# EAGLE design Wash_Hand_v1.3 (EAGLE 9.6.2)

## Sheet 1 of 2
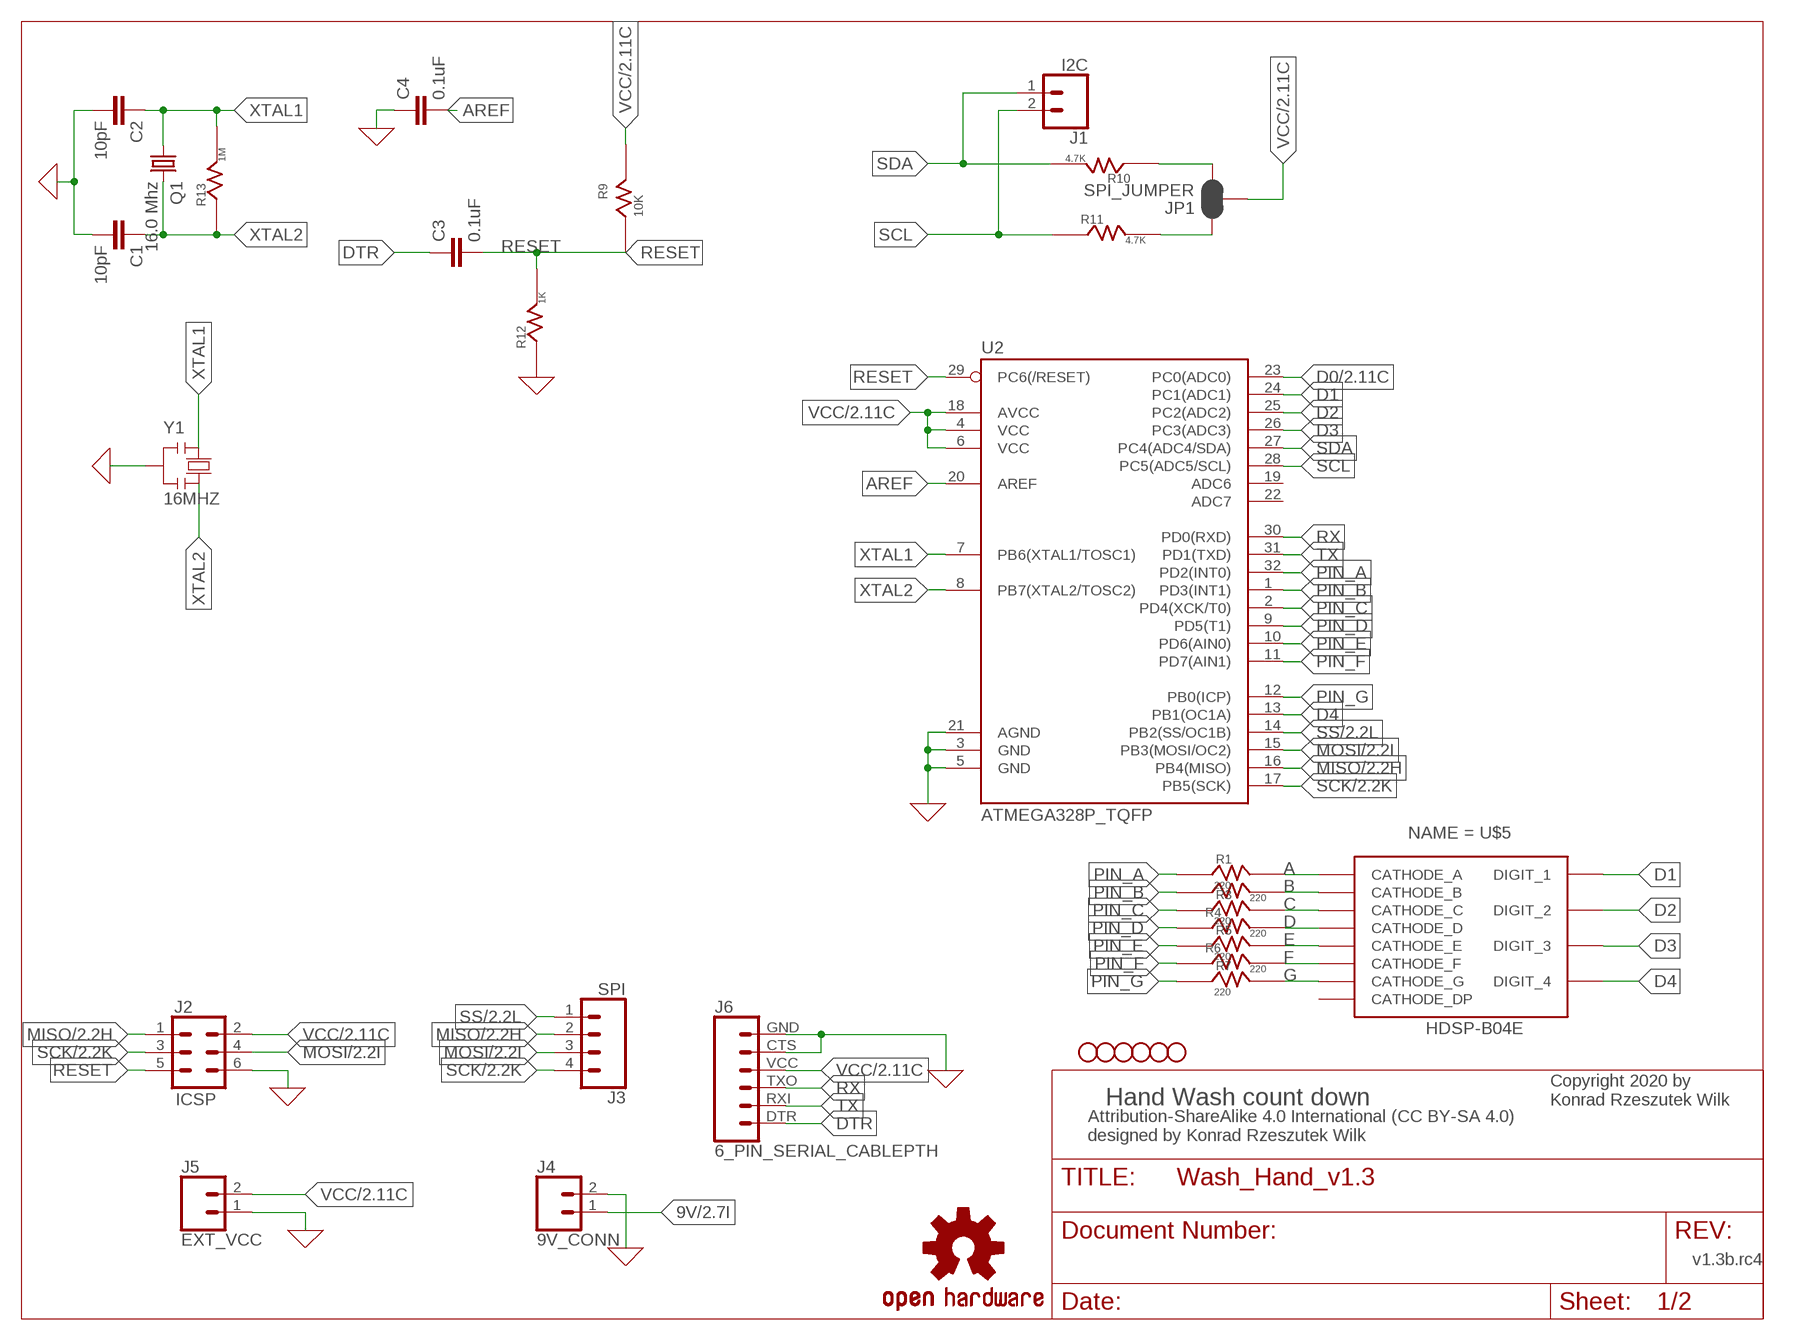
[diagram p0: schematic, sheet 1]
FRAME1 (LETTER_L): REVISION: v1.3b.rc4

### Parts
C1  10pF  10UF-1206-6.3V-20%  [1206]
C2  10pF  10UF-1206-6.3V-20%  [1206]
C3  0.1uF  1.0UF-1206-50V-10%  [1206]
C4  0.1uF  1.0UF-1206-50V-10%  [1206]
H1  STAND-OFF  [STAND-OFF]
H2  STAND-OFF  [STAND-OFF]
H3  STAND-OFF  [STAND-OFF]
H4  STAND-OFF  [STAND-OFF]
H5  STAND-OFF  [STAND-OFF]
H6  STAND-OFF  [STAND-OFF]
J1  I2C  CONN_02  [1X02]
J2  ICSP  CONN_03X2FEMALE  [2X3]
J3  SPI  CONN_04  [1X04]
J4  9V_CONN  CONN_02  [1X02]
J5  EXT_VCC  CONN_02  [1X02]
J6  6_PIN_SERIAL_CABLEPTH  [FTDI_BASIC]
JP1  SPI_JUMPER  JUMPER-SMT_3_2-NC_PASTE_SILK  [SMT-JUMPER_3_2-NC_PASTE_SILK]
LOGO1  OSHW-LOGOM  [OSHW-LOGO-M]
Q1  16.0 Mhz  CRYSTALHC49S  [HC49/S]
R1  220  RESISTORR1206  [1206]
R2  220  RESISTORR1206  [1206]
R3  220  RESISTORR1206  [1206]
R4  220  RESISTORR1206  [1206]
R5  220  RESISTORR1206  [1206]
R6  220  RESISTORR1206  [1206]
R7  220  RESISTORR1206  [1206]
R9  10K  RESISTORR1206  [1206]
R10  4.7K  RESISTORR1206  [1206]
R11  4.7K  RESISTORR1206  [1206]
R12  1K  RESISTORR1206  [1206]
R13  1M  RESISTORR1206  [1206]
U2  ATMEGA328P_TQFP  [TQFP32-08]
U$5  HDSP-B04E  [HDSP-B0XE]
Y1  16MHZ  RESONATORMU  [RESONATOR]

### Nets
0: C1.2 C2.2 C4.1 J2.6 J4.2 J5.1 J6.CTS J6.GND R12.1(R_1) U2.3(GND) U2.5(GND) U2.21(AGND) Y1.2 ; supply symbol labelled GND ; also sheet 2
9V: J4.1 ; also sheet 2
A: R1.2(R_2) U$5.PIN$11(CATHODE_A)
AREF: C4.2 U2.20(AREF)
B: R2.2(R_2) U$5.PIN$7(CATHODE_B)
C: R3.2(R_2) U$5.PIN$4(CATHODE_C)
D: R4.2(R_2) U$5.PIN$2(CATHODE_D)
D0: U2.23(PC0(ADC0)) ; also sheet 2
D1: U2.24(PC1(ADC1)) U$5.PIN12(DIGIT_1)
D2: U2.25(PC2(ADC2)) U$5.PIN$9(DIGIT_2)
D3: U2.26(PC3(ADC3)) U$5.PIN$8(DIGIT_3)
D4: U2.13(PB1(OC1A)) U$5.PIN$6(DIGIT_4)
DTR: C3.1 J6.DTR
E: R5.2(R_2) U$5.PIN$1(CATHODE_E)
F: R6.2(R_2) U$5.PIN$10(CATHODE_F)
G: R7.2(R_2) U$5.PIN$5(CATHODE_G)
MISO: J2.1 J3.2 U2.16(PB4(MISO)) ; also sheet 2
MOSI: J2.4 J3.3 U2.15(PB3(MOSI/OC2)) ; also sheet 2
N$5: JP1.3 R10.1(R_1)
N$6: JP1.1 R11.2(R_2)
PIN_A: R1.1(R_1) U2.32(PD2(INT0))
PIN_B: R2.1(R_1) U2.1(PD3(INT1))
PIN_C: R3.1(R_1) U2.2(PD4(XCK/T0))
PIN_D: R4.1(R_1) U2.9(PD5(T1))
PIN_E: R5.1(R_1) U2.10(PD6(AIN0))
PIN_F: R6.1(R_1) U2.11(PD7(AIN1))
PIN_G: R7.1(R_1) U2.12(PB0(ICP))
RESET: C3.2 J2.5 R9.1(R_1) R12.2(R_2) U2.29(PC6(/RESET))
RX: J6.TXO U2.30(PD0(RXD))
SCK: J2.3 J3.4 U2.17(PB5(SCK)) ; also sheet 2
SCL: J1.2 R11.1(R_1) U2.28(PC5(ADC5/SCL))
SDA: J1.1 R10.2(R_2) U2.27(PC4(ADC4/SDA))
SS: J3.1 U2.14(PB2(SS/OC1B)) ; also sheet 2
TX: J6.RXI U2.31(PD1(TXD))
VCC: J2.2 J5.2 J6.VCC JP1.2 R9.2(R_2) U2.4(VCC) U2.6(VCC) U2.18(AVCC) ; also sheet 2
XTAL1: C2.1 Q1.1 R13.2(R_2) U2.7(PB6(XTAL1/TOSC1)) Y1.1
XTAL2: C1.1 Q1.2 R13.1(R_1) U2.8(PB7(XTAL2/TOSC2)) Y1.3
Unconnected: U2.19(ADC6) U2.22(ADC7) U$5.PIN$3(CATHODE_DP)

### Notes on the sheet
- Hand Wash count down
- Copyright 2020 by
  Konrad Rzeszutek Wilk
- Attribution-ShareAlike 4.0 International (CC BY-SA 4.0) 
  designed by Konrad Rzeszutek Wilk

## Sheet 2 of 2
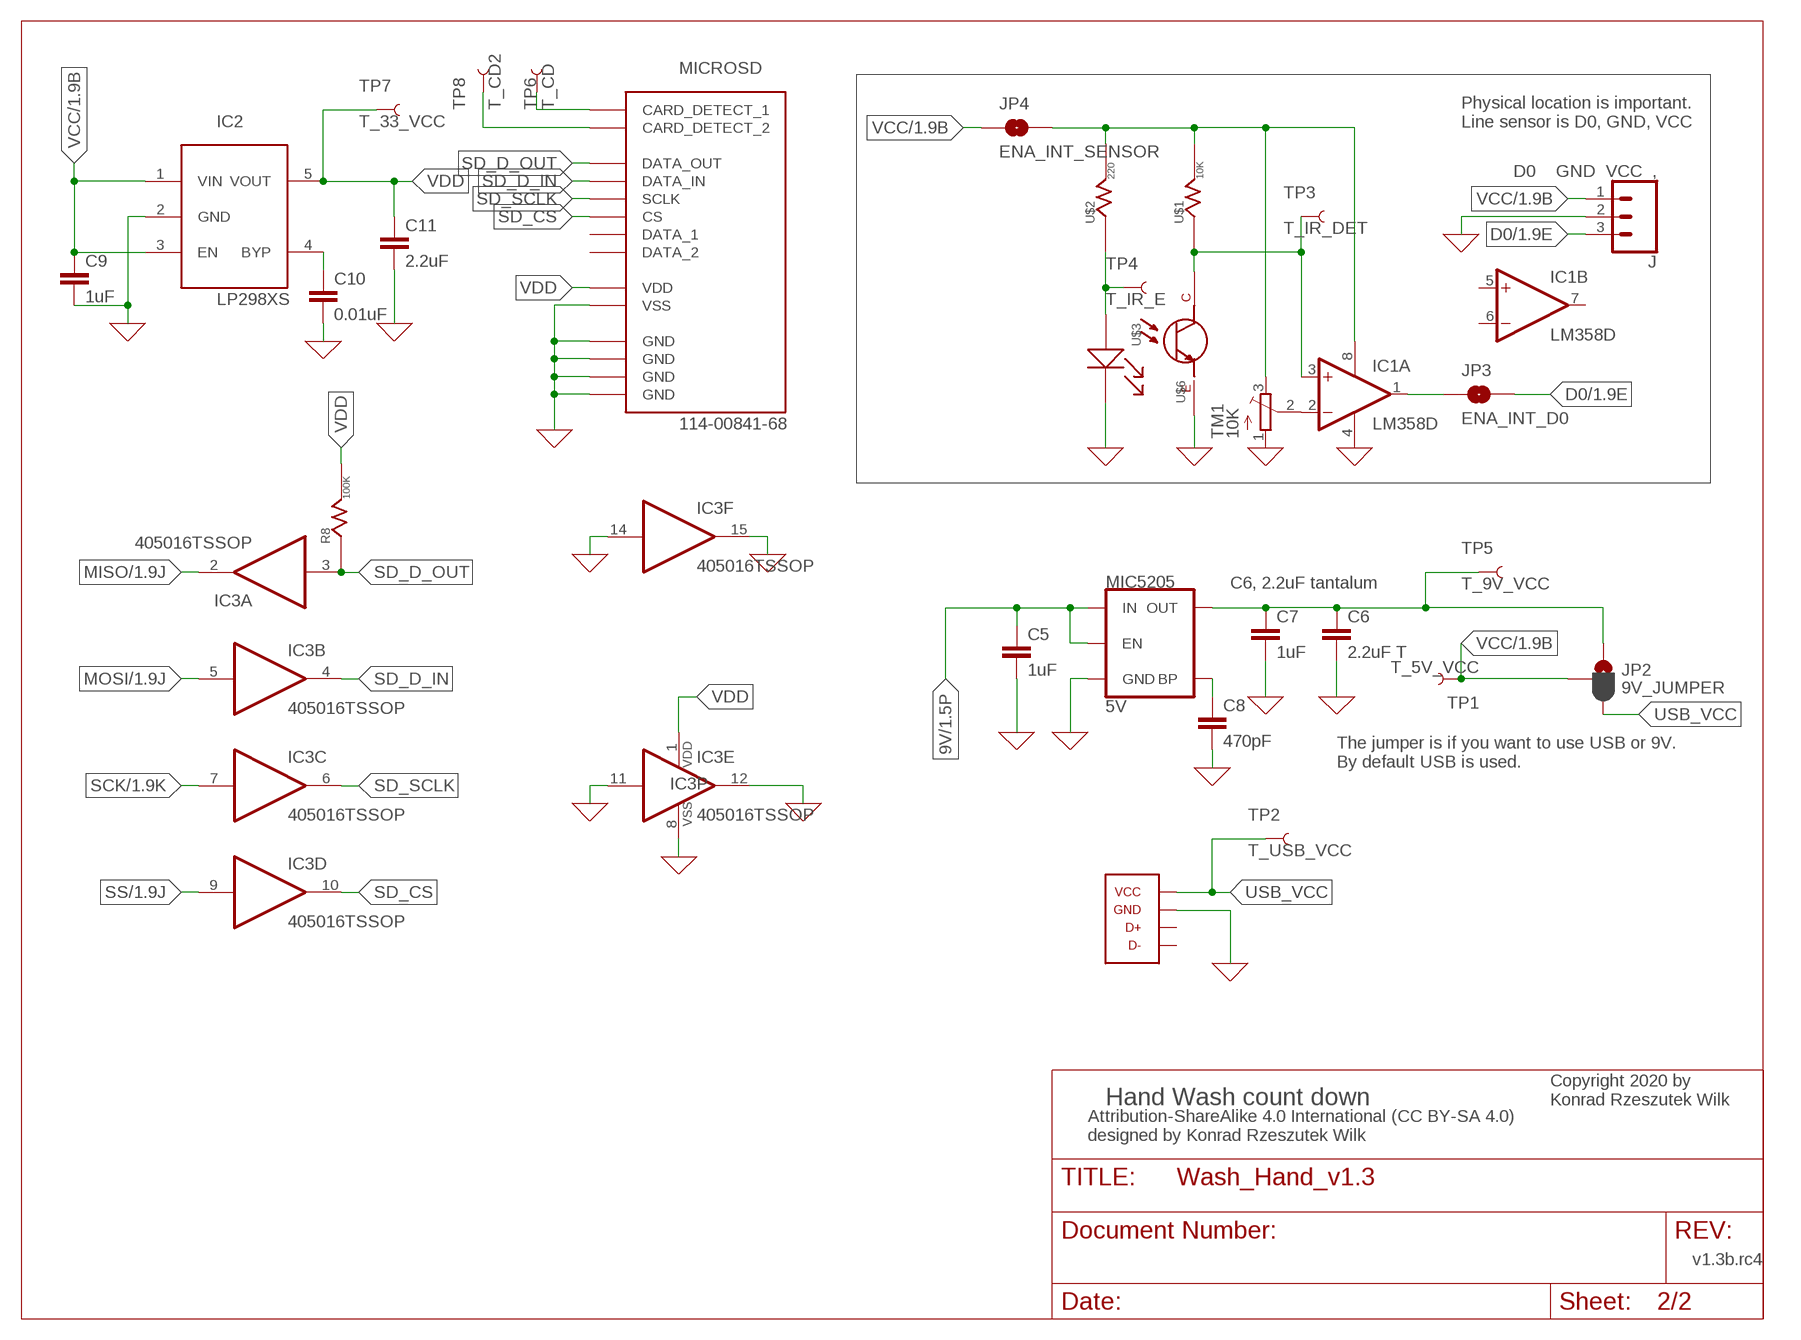
[diagram p1: schematic, sheet 2]
FRAME2 (LETTER_L): REVISION: v1.3b.rc4

### Parts
C5  1uF  1.0UF-1206-50V-10%  [1206]
C6  2.2uF T  1.0UF-1206-50V-10%  [1206]
C7  1uF  1.0UF-1206-50V-10%  [1206]
C8  470pF  1.0UF-1206-50V-10%  [1206]
C9  1uF  1.0UF-1206-50V-10%  [1206]
C10  0.01uF  1.0UF-1206-50V-10%  [1206]
C11  2.2uF  1.0UF-1206-50V-10%  [1206]
IC1  LM358D  [SO08]
IC2  LP298XS  [SOT23-5L]
IC3  405016TSSOP  [TSSOP16]
J  D0 GND VCC ,  CONN_03  [1X03]
JP2  9V_JUMPER  JUMPER-SMT_3_1-NC_PASTE_SILK  [SMT-JUMPER_3_1-NC_PASTE_SILK]
JP3  ENA_INT_D0  JUMPER-SMT_2_NO_NO-SILK_ROUND  [SMT-JUMPER_2_NO_NO-SILK_ROUND]
JP4  ENA_INT_SENSOR  JUMPER-SMT_2_NO_NO-SILK_ROUND  [SMT-JUMPER_2_NO_NO-SILK_ROUND]
MIC5205  5V  V_REG_MIC52055V  [SOT23-5]
MICROSD  114-00841-68  [114-00841-68]
R8  100K  RESISTORR1206  [1206]
TM1  10K  TRIMPOTTC33X  [TC33X]
TP1  T_5V_VCC  TEST-POINT3X4  [PAD.03X.04]
TP2  T_USB_VCC  TEST-POINT3X4  [PAD.03X.04]
TP3  T_IR_DET  TEST-POINT3X4  [PAD.03X.04]
TP4  T_IR_E  TEST-POINT3X4  [PAD.03X.04]
TP5  T_9V_VCC  TEST-POINT3X4  [PAD.03X.04]
TP6  T_CD  TEST-POINT3X4  [PAD.03X.04]
TP7  T_33_VCC  TEST-POINT3X4  [PAD.03X.04]
TP8  T_CD2  TEST-POINT3X4  [PAD.03X.04]
U$1  10K  RESISTORR1206  [1206]
U$2  220  RESISTORR1206  [1206]
U$3  LTE-302  [LTE-302]
U$4  USB_MICROB_10118194_AMPHENOL  [USB_MICROB_10118194_AMPHENOL]
U$6  LTR-301  [LTR-301]

### Nets
0: C5.2 C6.2 C7.2 C8.2 C9.2 C10.2 C11.2 IC1.4(P:V-) IC2.2(GND) IC3.8(P:VSS) IC3.11(E:I) IC3.12(E:O) IC3.14(F:I) IC3.15(F:O) J.2 MIC5205.2(GND) MICROSD.GND$1(GND) MICROSD.GND$2(GND) MICROSD.GND$3(GND) MICROSD.GND$4(GND) MICROSD.VSS TM1.1(A) U$3.C(K$1) U$4.5(GND) U$6.E(E$1) ; supply symbol labelled GND ; also sheet 1
9V: C5.1 MIC5205.1(IN) MIC5205.3(EN) ; also sheet 1
D0: IC1.1(A:OUT) J.3 JP3.1 JP3.2 ; also sheet 1
MISO: IC3.2(A:O) ; also sheet 1
MOSI: IC3.5(B:I) ; also sheet 1
N$1: MICROSD.CD_SW_1(CARD_DETECT_1) TP6.P$1
N$2: MICROSD.CD_SW_2(CARD_DETECT_2) TP8.P$1
N$10: C6.1 C7.1 JP2.1 MIC5205.5(OUT) TP5.P$1
N$11: TP4.P$1 U$2.1(R_1) U$3.A(A$1)
N$13: C10.1 IC2.4(BYP)
N$14: IC1.3(A:+IN) TP3.P$1 U$1.1(R_1) U$6.C(C$1)
N$15: IC1.8(P:V+) JP4.2 TM1.3(E) U$1.2(R_2) U$2.2(R_2)
N$16: IC1.2(A:-IN) TM1.2(S)
N$18: C8.1 MIC5205.4(BP)
SCK: IC3.7(C:I) ; also sheet 1
SD_CS: IC3.10(D:O) MICROSD.CS
SD_D_IN: IC3.4(B:O) MICROSD.DATA_IN
SD_D_OUT: IC3.3(A:I) MICROSD.DATA_OUT R8.1(R_1)
SD_SCLK: IC3.6(C:O) MICROSD.SCLK
SS: IC3.9(D:I) ; also sheet 1
USB_VCC: JP2.3 TP2.P$1 U$4.1(VCC)
VCC: C9.1 IC2.1(VIN) IC2.3(EN) J.1 JP2.2 JP4.1 TP1.P$1 ; also sheet 1
VDD: C11.1 IC2.5(VOUT) IC3.1(P:VDD) MICROSD.VDD R8.2(R_2) TP7.P$1
Unconnected: IC1.5(B:+IN) IC1.6(B:-IN) IC1.7(B:OUT) MICROSD.DATA_1 MICROSD.DATA_2 U$4.2(D-) U$4.3(D+)

### Notes on the sheet
- Physical location is important.
  Line sensor is D0, GND, VCC
- C6, 2.2uF tantalum
- The jumper is if you want to use USB or 9V.
  By default USB is used.
- Hand Wash count down
- Copyright 2020 by
  Konrad Rzeszutek Wilk
- Attribution-ShareAlike 4.0 International (CC BY-SA 4.0) 
  designed by Konrad Rzeszutek Wilk

## Library data of the parts
C1 C2 = SparkFun-Capacitors:10UF: 10.0µF ceramic capacitors A capacitor is a passive two-terminal electrical component used to store electrical energy temporarily in an electric field.; PROD_ID: CAP-10057; VALUE: 10uF
C3-C11 = SparkFun-Capacitors:1.0UF: 1µF ceramic capacitors A capacitor is a passive two-terminal electrical component used to store electrical energy temporarily in an electric field.; PROD_ID: CAP-09822; VALUE: 1.0uF
H1-H6 = SparkFun-Hardware:STAND-OFF: Stand Off Drill holes for mechanically mounting via screws, standoffs, etc. Note: Use the keepout ring to avoid running the screw head into surrounding components. Variant Overviews STAND-OFF - Mechanical footprint for a #4 phillips button head screw. STAND-OFF-TIGHT - Mechanical footprint for a #4 phillips button head screw, Example SparkFun Products Screw - Phillips Head (1/4", 4-40, 10 pack) <https://www.sparkfun.com/products/10453> (PRT-10453) Screw - Phillips Head (1/2", 4-40, 10 pack) <https://www.sparkfun.com/products/10452> (PRT-10452) Screw - Phillips Head (3/4", 4-40, 10 pack) <https://www.sparkfun.com/products/10451> (PRT-10451) Screw - Phillips Head (1", 4-40, 10 pack) <https://www.sparkfun.com/products/10450> (PRT-10450)
IC1 = linear:LM358: OP AMP also LM158; LM258; LM2904 Source: http://cache.national.com/ds/LM/LM158.pdf
IC2 = adafruit:LP298X
IC3 = darnok_4050:4050: Hex non-inverting BUFFER aka CD74HC4050PWR
J = SparkFun-Connectors:CONN_03: Multi connection point. Often used as Generic Header-pin footprint for 0.1 inch spaced/style header connections On any of the 0.1 inch spaced packages, you can populate with these: Break Away Headers - Straight <https://www.sparkfun.com/products/116> (PRT-00116) Break Away Male Headers - Right Angle <https://www.sparkfun.com/products/553> (PRT-00553) Female Headers <https://www.sparkfun.com/products/115> (PRT-00115) Break Away Headers - Machine Pin <https://www.sparkfun.com/products/117> (PRT-00117) Break Away Female Headers - Swiss Machine Pin <https://www.sparkfun.com/products/743> (PRT-00743) Stackable Header - 3 Pin (Female, 0.1") <https://www.sparkfun.com/products/13875> (PRT-13875) For SCREWTERMINALS and SPRING TERMINALS visit here: Screw Terimnals on SparkFun.com <https://www.sparkfun.com/search/results?term=Screw+Terminals> (5mm/3.5mm/2.54mm spacing) This device is also useful as a general connection point to wire up your design to another part of your project. Our various solder wires solder well into these plated through hole pads. Hook-Up Wire - Assortment (Stranded, 22 AWG) <https://www.sparkfun.com/products/11375> (PRT-11375) Hook-Up Wire - Assortment (Solid Core, 22 AWG) <https://www.sparkfun.com/products/11367> (PRT-11367) View the entire wire category on our website here <https://www.sparkfun.com/categories/141> Special notes: Molex polarized connector foot print use with SKU : PRT-08232 with associated crimp pins and housings.
J1 J4 J5 = SparkFun-Connectors:CONN_02: Multi connection point. Often used as Generic Header-pin footprint for 0.1 inch spaced/style header connections On any of the 0.1 inch spaced packages, you can populate with these: Break Away Headers - Straight <https://www.sparkfun.com/products/116> (PRT-00116) Break Away Male Headers - Right Angle <https://www.sparkfun.com/products/553> (PRT-00553) Female Headers <https://www.sparkfun.com/products/115> (PRT-00115) Break Away Headers - Machine Pin <https://www.sparkfun.com/products/117> (PRT-00117) Break Away Female Headers - Swiss Machine Pin <https://www.sparkfun.com/products/743> (PRT-00743) For SCREWTERMINALS and SPRING TERMINALS visit here: Screw Terimnals on SparkFun.com <https://www.sparkfun.com/search/results?term=Screw+Terminals> (5mm/3.5mm/2.54mm spacing) This device is also useful as a general connection point to wire up your design to another part of your project. Our various solder wires solder well into these plated through hole pads. Hook-Up Wire - Assortment (Stranded, 22 AWG) <https://www.sparkfun.com/products/11375> (PRT-11375) Hook-Up Wire - Assortment (Solid Core, 22 AWG) <https://www.sparkfun.com/products/11367> (PRT-11367) View the entire wire category on our website here <https://www.sparkfun.com/categories/141> Special notes: Molex polarized connector foot print use with: PRT-08233 with associated crimp pins and housings. 2.54_SCREWTERM for use with PRT-10571. 3.5mm Screw Terminal footprints for PRT-08084 5mm Screw Terminal footprints for use with PRT-08432
J2 = SparkFun-Connectors:CONN_03X2: Multi connection point. Often used as Generic Header-pin footprint for 0.1 inch spaced/style header connections You can populate with any combo of single row headers, but if you'd like an exact match, check these: Header - 2x3 (Male, 0.1") <https://www.sparkfun.com/products/12807> (PRT-12807) Header - 2x3 (Female, 0.1") <https://www.sparkfun.com/products/13010> (PRT-13010) 2x3 Pin Shrouded Header <https://www.sparkfun.com/products/10877> (PRT-10877) On any of the 0.1 inch spaced packages, you can populate with these: Break Away Headers - Straight <https://www.sparkfun.com/products/116> (PRT-00116) Break Away Male Headers - Right Angle <https://www.sparkfun.com/products/553> (PRT-00553) Female Headers <https://www.sparkfun.com/products/115> (PRT-00115) Break Away Headers - Machine Pin <https://www.sparkfun.com/products/117> (PRT-00117) Break Away Female Headers - Swiss Machine Pin <https://www.sparkfun.com/products/743> (PRT-00743) Special note: the shrouded connector mates well with our 3x2 ribbon cables: Ribbon Crimp Connector - 6-pin (2x3, Female) <https://www.sparkfun.com/products/10651> (PRT-10651) Ribbon Cable - 6 wire (15ft) <https://www.sparkfun.com/products/10646> (PRT-10646); PROD_ID: CONN-11566; VALUE: FEMALE 2x3
J3 = SparkFun-Connectors:CONN_04: Multi connection point. Often used as Generic Header-pin footprint for 0.1 inch spaced/style header connections On any of the 0.1 inch spaced packages, you can populate with these: Break Away Headers - Straight <https://www.sparkfun.com/products/116> (PRT-00116) Break Away Male Headers - Right Angle <https://www.sparkfun.com/products/553> (PRT-00553) Female Headers <https://www.sparkfun.com/products/115> (PRT-00115) Break Away Headers - Machine Pin <https://www.sparkfun.com/products/117> (PRT-00117) Break Away Female Headers - Swiss Machine Pin <https://www.sparkfun.com/products/743> (PRT-00743) For SCREWTERMINALS and SPRING TERMINALS visit here: Screw Terimnals on SparkFun.com <https://www.sparkfun.com/search/results?term=Screw+Terminals> (5mm/3.5mm/2.54mm spacing) This device is also useful as a general connection point to wire up your design to another part of your project. Our various solder wires solder well into these plated through hole pads. Hook-Up Wire - Assortment (Stranded, 22 AWG) <https://www.sparkfun.com/products/11375> (PRT-11375) Hook-Up Wire - Assortment (Solid Core, 22 AWG) <https://www.sparkfun.com/products/11367> (PRT-11367) View the entire wire category on our website here <https://www.sparkfun.com/categories/141> Special notes: Molex polarized connector foot print use with SKU : PRT-08231 with associated crimp pins and housings. 1MM SMD Version SKU: PRT-10208; PROD_ID: CONN-09696
J6 = SparkFun-Connectors:6_PIN_SERIAL_CABLE: 6-pin header connection for use with the "FTDI BASIC" pinout - CABLE SIDE. Also known as "Arduino Serial Program Header". This is used on a design to provide a 6-pin connection point for serial communication usually from a USB cable (D+/D-) to these headers (RX/TX). It also has the remaining pins necessary for programming in the Arduino evironment (DTR, GND, and sometimes VCC). Note, this device has "CABLE" in the name. It is intended to be used on a design that usually lives on the end of your USB cable and prvides the converter chip (FTDI232 or FTDI231x) to commnicate serial RX/TX. The "sister" device, named "TARGET" is inteneded to be used on a design that contains a target micro-controller that you wish to program. You can populate with some of these: Female Headers <https://www.sparkfun.com/products/115> (PRT-00115) For reference (or to suit your programming needs) check out these designs: SparkFun FTDI Basic Breakout - 5V <https://www.sparkfun.com/products/9716> (DEV-09716) SparkFun FTDI Basic Breakout - 3.3V <https://www.sparkfun.com/products/9873> (DEV-09873) SparkFun FTDI SmartBasic <https://www.sparkfun.com/products/12935> (DEV-12935) SparkFun Beefy 3 - FTDI Basic Breakout <https://www.sparkfun.com/products/13746> (DEV-13746)
JP1 = SparkFun-Jumpers:JUMPER-SMT_3_2-NC_PASTE: Normally closed solder jumper (2 of 2 connections) This jumper has an aperture in the stencil to allow solder paste to bridge both connections. Both connections are normally closed (NC). Wick off the solder to open the connection(s). Reapply solder to reclose the connection(s).
JP2 = SparkFun-Jumpers:JUMPER-SMT_3_1-NC_PASTE: Normally closed solder jumper (1 of 2 connections) This jumper has an aperture in the stencil to allow solder paste to bridge one of the two connections. One connection is normally closed (NC), while the other is normally open (NO). Wick off the solder to open the connection. Reapply solder to reclose the connection. Apply solder to the other side instead to change the current path.
JP3 JP4 = SparkFun-Jumpers:JUMPER-SMT_2_NO: Normally open jumper This jumper has two pads in close proximity to each other. Apply solder to close the connection. Round pads are easier to solder for beginners, but are a lot larger. SparkFun Product that uses the round pads: SparkFun EL Sequencer <https://www.sparkfun.com/products/12781>
LOGO1 = SparkFun-Aesthetics:OSHW-LOGO: Open-Source Hardware (OSHW) Logo This logo indicates the piece of hardware it is found on incorporates a OSHW license and/or adheres to the definition of open source hardware found here: http://freedomdefined.org/OSHW
MIC5205 = SparkFun-IC-Power:V_REG_MIC5205: V_REG MIC5205 Standard 3.3V, 5V, and Adjustable 150mA LDO voltage regulator in SOT-23 layout. Micrel part MIC5205. BP (by-pass) pin is used to lower output noise with 470pF cap, may be left open. On the adjustable version BP is used to set output.; PROD_ID: VREG-00823
MICROSD = darnok_microsd:114-00841-68: Amphenol MicroSD Push Pull Data sheet is available at here <https://media.digikey.com/pdf/Data%20Sheets/Amphenol%20PDFs/114-00841-68.pdf>.
Q1 = adafruit:CRYSTAL: CRYSTAL; OC_FARNELL: 1667008; OC_NEWARK: unknown
R1-R13 U$1 U$2 = darnok_common:RESISTOR
TM1 = adafruit:TRIMPOT: SMT trimmer potentiometer part number TC33X http://www.ladyada.net/library/eagle
TP1-TP8 = SparkFun-Connectors:TEST-POINT: SparkFun Test Points Bare copper test points for troubleshooting or In-Circuit-Testing. These are used by our Production team for verifying production board runs using pogo-pins on test beds. SparkFun Products: SparkFun LSM9DS1 Breakout <https://www.sparkfun.com/products/13284> SparkFun PSOC <https://www.sparkfun.com/products/13714> SparkFun Load Cell Amplifier <https://www.sparkfun.com/products/13879>
U2 = SparkFun-IC-Microcontroller:ATMEGA328P_TQFP: Popular 328P in QFP Storefront component: ATmega328 - TQFP <https://www.sparkfun.com/products/13448> (COM-13448) Datasheet <http://www.sparkfun.com/datasheets/Components/SMD/ATMega328.pdf> SparkFun Products SparkFun RedBoard - Programmed with Arduino <https://www.sparkfun.com/products/12757> (DEV-12757) Arduino Pro Mini 328 - 5V/16MHz <https://www.sparkfun.com/products/11113> (DEV-11113) Arduino Pro Mini 328 - 3.3V/8MHz <https://www.sparkfun.com/products/11114> (DEV-11114) SparkFun OpenLog <https://www.sparkfun.com/products/13712> (DEV-13712) SparkFun MicroView - OLED Arduino Module <https://www.sparkfun.com/products/12923> (DEV-12923) SparkFun Digital Sandbox <https://www.sparkfun.com/products/12651> (DEV-12651) SparkFun PicoBoard <https://www.sparkfun.com/products/11888> (WIG-11888) Arduino Fio <https://www.sparkfun.com/products/10116> (DEV-10116) LilyPad Arduino 328 Main Board <https://www.sparkfun.com/products/13342> (DEV-13342) SparkFun RedStick <https://www.sparkfun.com/products/13741> (DEV-13741) LilyPad MP3 <https://www.sparkfun.com/products/11013> (DEV-11013) LilyPad Arduino SimpleSnap <https://www.sparkfun.com/products/10941> (DEV-10941) SparkFun Stepoko <https://www.sparkfun.com/products/13899> (ROB-13899) SparkFun Geiger Counter <https://www.sparkfun.com/products/11345> (SEN-11345) SparkFun EL Sequencer <https://www.sparkfun.com/products/12781> (COM-12781) Arduino Pro 328 - 5V/16MHz <https://www.sparkfun.com/products/10915> (DEV-10915) CryptoCape <https://www.sparkfun.com/products/12773> (DEV-12773) SparkFun IR Thermometer Evaluation Board - MLX90614 <https://www.sparkfun.com/products/10740> (SEN-10740) SparkFun RedBot Mainboard <https://www.sparkfun.com/products/12097> (ROB-12097) Arduino Pro 328 - 3.3V/8MHz <https://www.sparkfun.com/products/10914> (DEV-10914) SparkFun Block for Intel® Edison - Arduino <https://www.sparkfun.com/products/13036> (DEV-13036) SparkFun Simon Says - Surface Mount Soldering Kit <https://www.sparkfun.com/products/10935> (KIT-10935) SparkFun 7-Segment Serial Display - Red <https://www.sparkfun.com/products/11441> (COM-11441) SparkFun 7-Segment Serial Display - White <https://www.sparkfun.com/products/11629> (COM-11629) SparkFun 7-Segment Serial Display - Yellow <https://www.sparkfun.com/products/11443> (COM-11443) SparkFun 7-Segment Serial Display - Kelly Green <https://www.sparkfun.com/products/11440> (COM-11440) SparkFun 7-Segment Serial Display - Blue <https://www.sparkfun.com/products/11442> (COM-11442) SparkFun OpenSegment Serial Display - 20mm (Blue) <https://www.sparkfun.com/products/11647> (COM-11647) SparkFun OpenSegment Serial Display - 20mm (Green) <https://www.sparkfun.com/products/11646> (COM-11646) SparkFun OpenSegment Serial Display - 20mm (White) <https://www.sparkfun.com/products/11648> (COM-11648) SparkFun OpenSegment Serial Display - 20mm (Red) <https://www.sparkfun.com/products/11644> (COM-11644) SparkFun OpenSegment Serial Display - 20mm (Yellow) <https://www.sparkfun.com/products/11645> (COM-11645) SparkFun OpenSegment Shield <https://www.sparkfun.com/products/13190> (DEV-13190); PROD_ID: IC-09069
U$3 = darnok_sensors:LTE-302
U$4 = darnok_usb:USB_MICROB_10118194_AMPHENOL
U$5 = darnok_led:HDSP-B04E: 7 Segment LED light 0.56"
U$6 = darnok_sensors:LTR-301
Y1 = darnok_common:RESONATOR

## Board
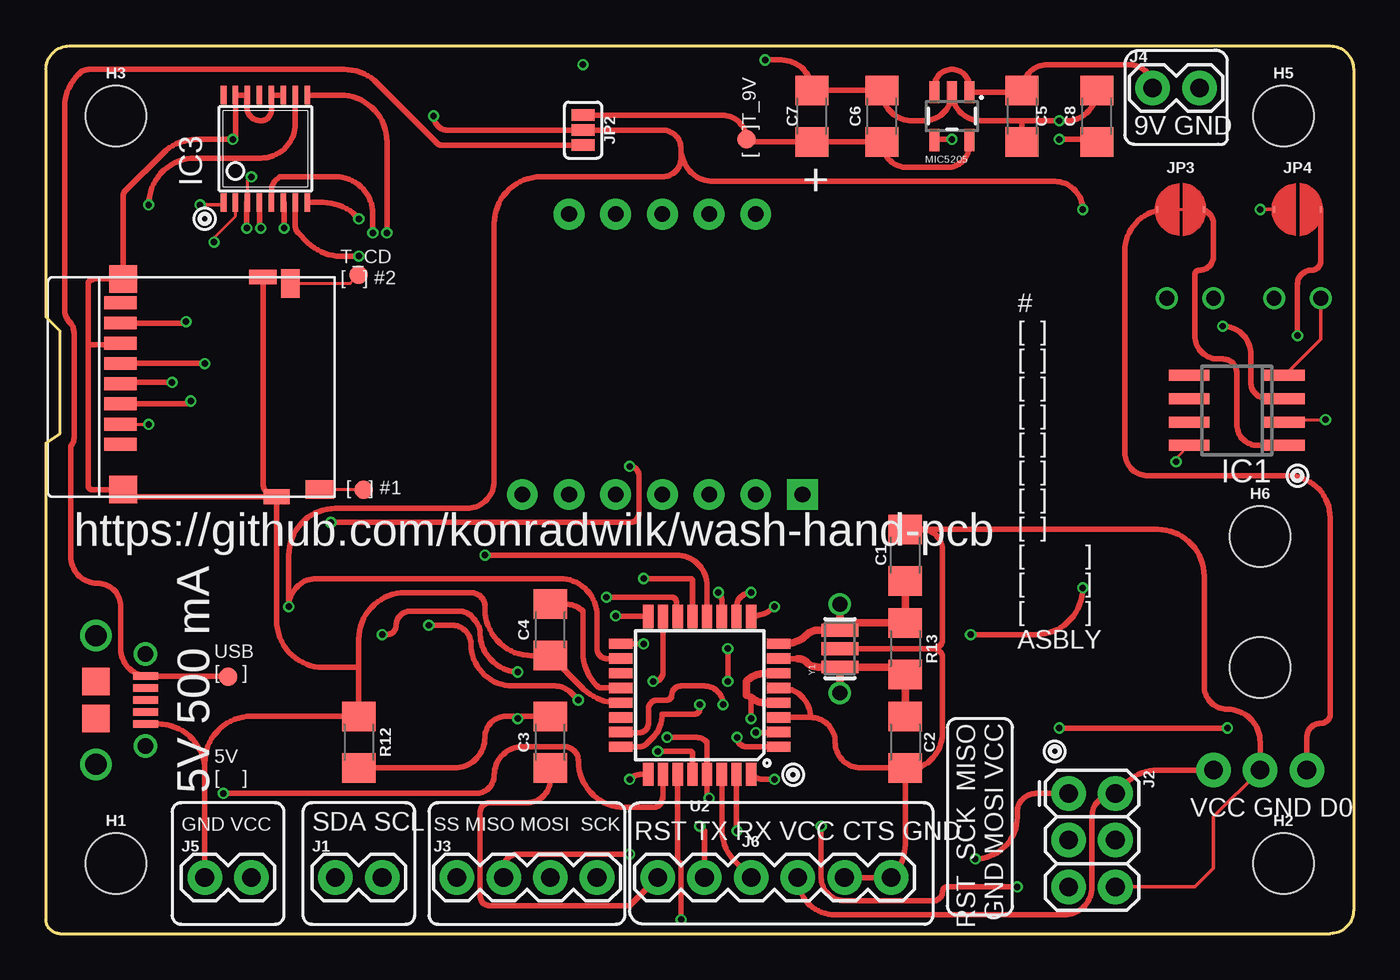
[diagram p2: board, top side]
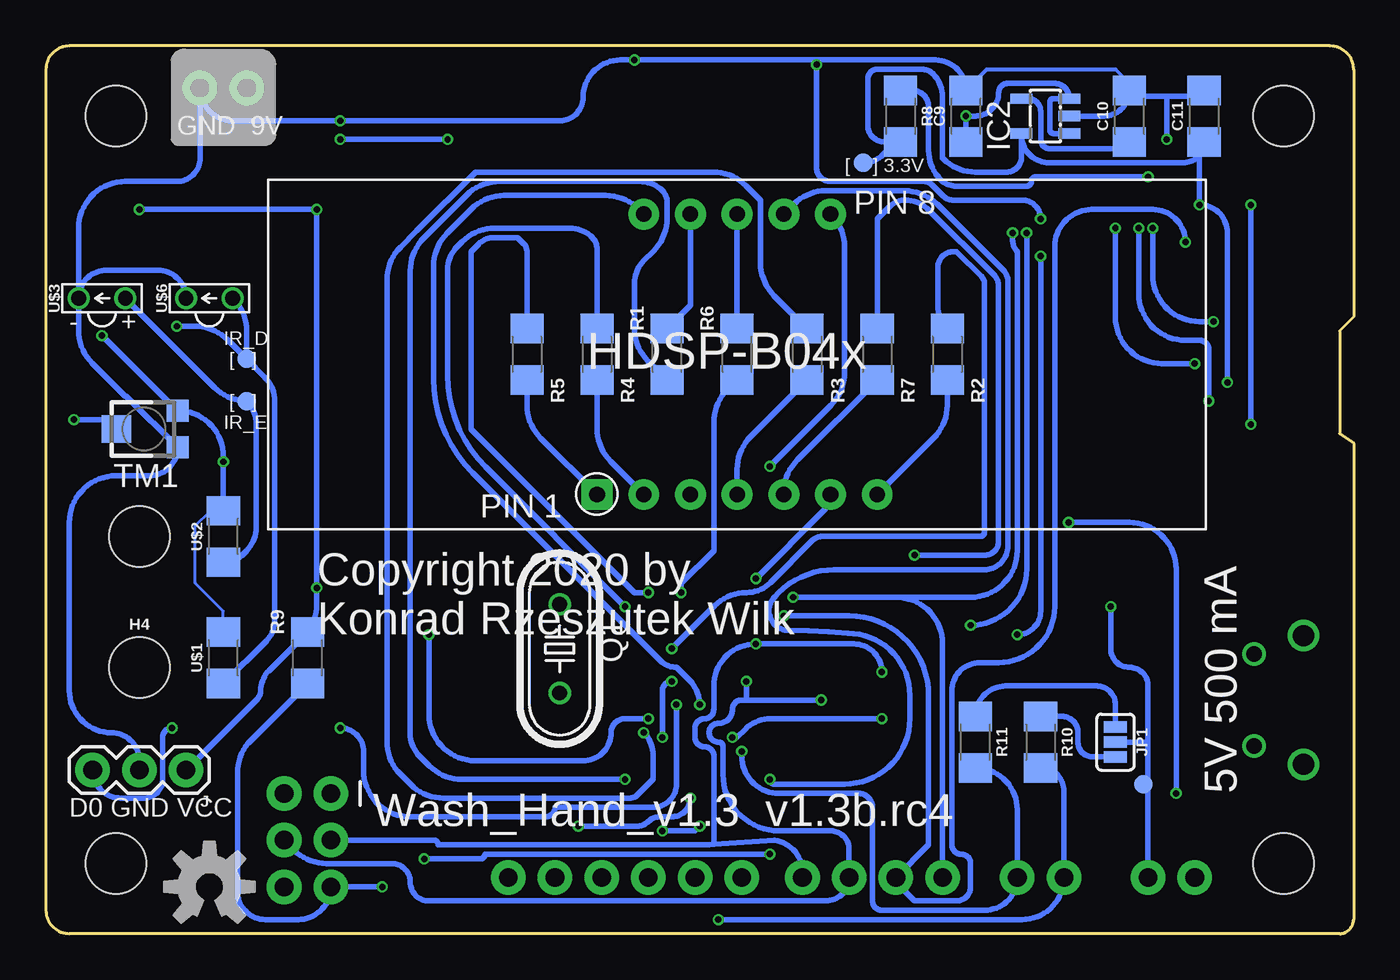
[diagram p3: board, bottom side, seen from below]

Size 71.12 x 48.26 mm. Coordinates in mm from the lower left corner, seen from the top.
Outline: 0,46.99 0,33.53 0.76,32.77 0.76,27.18 0,26.67 0,0.76 arc90 0.76,0 69.85,0 arc90 71.12,1.27 71.12,46.99 arc90 69.85,48.26 1.27,48.26 arc90 0,46.99
Copper layers (1*16): Top 0.035559375mm / dielectric 1.6mm / Bottom 0.035559375mm
Design rules "oshpark-2layer": minimum track width 6mil, minimum drill 10mil, track to track 6mil, track to pad 6mil, pad to pad 6mil, via to via 6mil, smd to smd 6mil, copper to edge 15mil, drill to drill 6mil, minimum pad ring 5mil, minimum via ring 5mil, stop-mask expansion 2.5mil, vias tented up to drill 0mil, thermal gap 10mil

### Footprints (pad centres in the part's own frame; a part is rotated, then mirrored left to right if it is on the bottom)
1206 = smd 1.6 x 1.8: 1 -1.4,0; 2 1.4,0
STAND-OFF = hole 3.302: 0,0
SO08 = smd 0.6 x 2.2: 1 -1.905,-2.6; 2 -0.635,-2.6; 3 0.635,-2.6; 4 1.905,-2.6; 5 1.905,2.6; 6 0.635,2.6; 7 -0.635,2.6; 8 -1.905,2.6
SOT23-5L = smd 0.55 x 1.2: 1 -0.95,-1.3; 2 0,-1.3; 3 0.95,-1.3; 4 0.95,1.3; 5 -0.95,1.3
TSSOP16 = smd 0.305 x 0.991: 1 -2.275,-2.918; 2 -1.625,-2.918; 3 -0.975,-2.918; 4 -0.325,-2.918; 5 0.325,-2.918; 6 0.975,-2.918; 7 1.625,-2.918; 8 2.275,-2.918; 9 2.275,2.918; 10 1.625,2.918; 11 0.975,2.918; 12 0.325,2.918; 13 -0.325,2.918; 14 -0.975,2.918; 15 -1.625,2.918; 16 -2.275,2.918
1X03 = drill 1.016 pad 1.88: 1 0,0; 2 2.54,0; 3 5.08,0
1X02 = drill 1.016 pad 1.88: 1 0,0; 2 2.54,0
2X3 = drill 1.016 pad 1.88: 1 0,0; 2 0,2.54; 3 2.54,0; 4 2.54,2.54; 5 5.08,0; 6 5.08,2.54
1X04 = drill 1.016 pad 1.88: 1 0,0; 2 2.54,0; 3 5.08,0; 4 7.62,0
FTDI_BASIC = drill 1.016 pad 1.88: CTS 10.16,0; DTR 0,0; GND 12.7,0; RXI 2.54,0; TXO 5.08,0; VCC 7.62,0
SMT-JUMPER_3_2-NC_PASTE_SILK = smd 0.635 x 1.27: 1 -0.813,0; 2 0,0; 3 0.813,0
SMT-JUMPER_3_1-NC_PASTE_SILK = smd 0.635 x 1.27: 1 -0.813,0; 2 0,0; 3 0.813,0
SMT-JUMPER_2_NO_NO-SILK_ROUND = smd 0.152 x 0.305: 1 -1.27,0; 2 1.27,0
SOT23-5 = smd 0.55 x 1.2: 1 -0.95,-1.3; 2 0,-1.3; 3 0.95,-1.3; 4 0.95,1.3; 5 -0.95,1.3
114-00841-68 = smd 1 x 1.55: CD_SW_1 5.57,4.96 | smd 1.55 x 1: CD_SW_2 -5.63,3.36 | smd 0.7 x 1.75: CS 2.02,-5.89; DATA_1 -4.58,-5.89; DATA_2 3.12,-5.89; DATA_IN 0.92,-5.89; DATA_OUT -3.48,-5.89; SCLK -1.28,-5.89; VDD -0.18,-5.89; VSS -2.38,-5.89 | smd 0.8 x 1.4: GND$1 5.97,2.61 | smd 1.5 x 1.5: GND$2 5.57,-5.74; GND$3 -5.88,-5.74 | smd 0.8 x 1.5: GND$4 -5.98,1.86
HC49/S = drill 0.813: 1 -2.413,0; 2 2.413,0
TC33X = smd 1.2 x 1.2: 1 -1,-1.825; 3 1,-1.825 | smd 1.5 x 1.6: 2 0,1.5
PAD.03X.04 = smd 1.016 x 1.016: P$1 0,0
TQFP32-08 = smd 1.27 x 0.559: 1 -4.293,2.8; 2 -4.293,2; 3 -4.293,1.2; 4 -4.293,0.4; 5 -4.293,-0.4; 6 -4.293,-1.2; 7 -4.293,-2; 8 -4.293,-2.8; 17 4.293,-2.8; 18 4.293,-2; 19 4.293,-1.2; 20 4.293,-0.4; 21 4.293,0.4; 22 4.293,1.2; 23 4.293,2; 24 4.293,2.8 | smd 0.559 x 1.27: 9 -2.8,-4.293; 10 -2,-4.293; 11 -1.2,-4.293; 12 -0.4,-4.293; 13 0.4,-4.293; 14 1.2,-4.293; 15 2,-4.293; 16 2.8,-4.293; 25 2.8,4.293; 26 2,4.293; 27 1.2,4.293; 28 0.4,4.293; 29 -0.4,4.293; 30 -1.2,4.293; 31 -2,4.293; 32 -2.8,4.293
LTE-302 = drill 0.8: A 1.27,0; C -1.27,0
USB_MICROB_10118194_AMPHENOL = smd 0.4 x 1.35: 1 -1.3,4.15; 2 -0.65,4.15; 3 0,4.15; 4 0.65,4.15; 5 1.3,4.15 | smd 1.5 x 1.5: P$1 -1,1.45; P$2 1,1.45 | drill 0.85 pad 1.25: P$8 -2.5,4.15; P$9 2.5,4.15 | drill 1.15 pad 1.55: P$10 -3.5,1.45; P$11 3.5,1.45
HDSP-B0XE = drill 0.85 pad 1.676: PIN12 -5.08,7.62; PIN$2 -5.08,-7.62; PIN$3 -2.54,-7.62; PIN$4 0,-7.62; PIN$5 2.54,-7.62; PIN$6 5.08,-7.62; PIN$7 7.62,-7.62; PIN$8 5.08,7.62; PIN$9 2.54,7.62; PIN$10 0,7.62; PIN$11 -2.54,7.62 | drill 0.85 pad 1.676 square: PIN$1 -7.62,-7.62
LTR-301 = drill 0.8: C 1.27,0; E -1.27,0
RESONATOR = smd 0.7 x 2: 1 -1,0; 2 0,0; 3 1,0

### Placement (x,y rotation side)
C1  46.74,20.57 90 top
C2  46.74,10.41 270 top
C3  27.43,10.41 90 top
C4  27.43,16.51 90 top
C5  53.09,44.45 270 top
C6  45.47,44.45 90 top
C7  41.66,44.45 90 top
C8  57.15,44.45 90 top
C9  21.08,44.45 90 bottom
C10  12.19,44.45 90 bottom
C11  8.13,44.45 90 bottom
H1  3.81,3.81 0 top
H2  67.31,3.81 0 top
H3  3.81,44.45 0 top
H4  66.04,14.48 0 bottom
H5  67.31,44.45 0 top
H6  66.04,21.59 0 top
IC1  64.77,28.45 90 top
IC2  16.76,44.45 90 bottom
IC3  11.94,42.67 0 top
J  63.5,8.89 180 bottom
J1  15.75,3.05 0 top
J2  55.63,7.62 270 top
J3  22.35,3.05 0 top
J4  60.2,45.97 0 top
J5  8.64,3.05 0 top
J6  33.27,3.05 0 top
JP1  12.95,10.41 270 bottom
JP2  29.21,43.69 270 top
JP3  61.72,39.37 0 top
JP4  68.07,39.37 0 top
LOGO1  62.23,2.54 0 bottom
MIC5205  49.28,44.45 180 top
MICROSD  9.94,29.72 270 top
Q1  43.18,15.49 90 bottom
R1  37.34,31.5 90 bottom
R2  22.1,31.5 270 bottom
R3  29.72,31.5 270 bottom
R4  41.15,31.5 270 bottom
R5  44.96,31.5 270 bottom
R6  33.53,31.5 90 bottom
R7  25.91,31.5 270 bottom
R8  24.64,44.45 270 bottom
R9  56.9,14.99 90 bottom
R10  17.02,10.41 270 bottom
R11  20.57,10.41 90 bottom
R12  17.02,10.41 270 top
R13  46.74,15.49 270 top
TM1  65.79,27.43 90 bottom
TP1  11.43,8.13 0 bottom
TP2  9.91,13.97 0 top
TP3  60.2,31.24 180 bottom
TP4  60.2,28.96 180 bottom
TP5  38.1,43.18 0 top
TP6  17.27,24.13 0 top
TP7  26.67,41.91 180 bottom
TP8  17.02,35.81 0 top
U2  35.56,12.95 180 top
U$1  61.47,14.99 90 bottom
U$2  61.47,21.59 90 bottom
U$3  68.07,34.54 0 bottom
U$4  1.27,12.7 270 top
U$5  33.53,31.5 0 bottom
U$6  62.23,34.54 0 bottom
Y1  43.18,15.49 90 top

### Tracks (layer width: path | path; a pad name or v marks a point on that pad's centre or on a via)
0  (via drill 0.35)
  Top 0.203: J2.6 62.48,2.54 63.5,3.56 63.5,6.35 J.2 | 10.92,45.55 IC3.14 | IC1.4 69.34,32.33 U$3.C
  Top 0.305: U2.21 31.04,12.55 arc-45 29.24,13.3 C4.1 26.42,15.11 arc-90 23.88,17.65 23.88,17.78 arc90 23.11,18.54 19.56,18.54 arc90 17.02,16 17.02,14.48 | J6.CTS J6.GND 45.99,3.07 arc45 46.74,4.86 46.74,8.89 | 46.74,8.89 C2.2 44.33,9.01 arc-90 42.93,10.41 arc90 41.59,11.75 | 8.64,8.86 J5.1 | MICROSD.GND$1 12.55,17.02 arc90 15.09,14.48 17.02,14.48 | 17.02,14.48 R12.1 11.18,11.81 arc90 8.64,9.27 8.64,8.86 | v39.12,47.5 40.01,47.5 arc-90 C7.2 C6.2 arc90 47.12,44.2 47.75,44.2 arc90 49.28,45.72 MIC5205.2 arc90 50.83,44.2 53.09,44.2 | MICROSD.GND$1 4.6,23.75 | MICROSD.GND$1 arc-90 11.8,24.5 MICROSD.GND$4 | 2.29,32 2.29,35.31 arc-90 2.54,35.56 arc-90 2.58,35.6 MICROSD.GND$3 4.2,40.1 arc-45 4.32,40.39 6.37,42.44 arc-45 8.16,43.18 v10.16,43.18 arc90 10.31,43.33 IC3.15 IC3.14 | 2.29,32 2.29,24.38 arc90 2.54,24.13 4.18,24.13 arc90 4.56,23.75 4.6,23.75 | MICROSD.VSS arc-90 3.96,32 2.29,32 | U2.3 41.59,11.75 | 41.59,11.75 arc90 39.99,13.35 U2.5 | Y1.2 48.26,15.49 | 48.26,15.49 arc-90 48.77,14.99 48.77,10.92 arc-90 46.74,8.89 | C1.2 47.62,21.97 | 47.62,21.97 arc-90 48.77,20.83 48.77,16 arc-90 48.26,15.49 | IC3.8 15.07,39.75 arc-45 16.87,39.01 v17.02,38.86 | U$4.5 6.1,11.4 arc-90 8.64,8.86 | 47.62,21.97 60.45,21.97 arc-90 62.99,19.43 62.99,13.46 arc90 64.26,12.19 arc-90 66.04,10.41 J.2 | 53.09,44.2 C5.2 | IC3.11 IC3.12 12.26,44.77 arc-90 11.68,44.2 arc-90 10.92,44.96 10.92,45.55 | C8.2 arc-90 55.5,44.2 v55.12,44.2 53.09,44.2 | MICROSD.GND$2 arc90 4.6,23.75
  Bottom 0.152: 8.45,45.53 C11.2
  Bottom 0.203: C10.2 12.19,46.23 12.95,46.99
  Bottom 0.229: C9.2 19.94,46.99 12.95,46.99
  Bottom 0.305: C9.2 arc-90 22.73,47.5 29.21,47.5 | 29.21,47.5 v39.12,47.5 39.88,47.5 arc-90 41.91,45.47 arc90 43.18,44.2 v55.12,44.2 60.96,44.2 arc90 J4.2 62.74,42.16 arc90 64.01,40.89 66.8,40.89 arc-90 69.34,38.35 U$3.C | 29.21,47.5 v29.21,47.24 29.21,41.66 arc-90 28.45,40.89 23.37,40.89 arc45 22.93,40.71 22.35,40.13 arc-45 21.74,39.88 18.03,39.88 arc90 v17.02,38.86 | U$3.C 69.34,32.8 arc-45 68.6,31.01 66.8,29.21 arc45 66.69,29.16 TM1.1 arc90 65.5,24.89 67.31,24.89 arc-90 69.85,22.35 69.85,13.21 arc-90 67.56,10.92 arc90 66.04,9.4 J.2 | U$6.E arc-90 65.02,36.07 67.82,36.07 arc-90 U$3.C | 10.16,45.53 11.87,45.53 arc90 C10.2 arc90 13.59,44.45 IC2.2 | 8.45,45.53 10.16,45.53 | 10.16,45.53 v10.16,43.18
9V
  Top 0.305: J4.1 arc90 58.93,47.24 54.48,47.24 arc90 C5.1 arc-90 52.99,45.75 MIC5205.1 50.23,46.04 arc90 49.28,46.99 arc90 48.33,46.04 MIC5205.3
A
  Bottom 0.305: R1.2 36.07,34.17 U$5.PIN$11
AREF
  Top 0.305: U2.20 30.23,13.35 arc-45 29.97,13.46 29.95,13.48 arc-45 29.21,15.28 29.21,17.53 arc45 28.28,17.91 C4.2
B
  Bottom 0.305: U$5.PIN$7 22.84,26.94 arc-45 22.1,28.74 R2.2
C
  Bottom 0.305: R3.2 32.78,27.03 arc-45 33.53,25.23 U$5.PIN$4
D
  Bottom 0.305: R4.2 41.15,27.47 arc-45 40.4,25.67 U$5.PIN$2
D0  (via drill 0.35)
  Top 0.152: 67.31,26.54 IC1.1 | JP3.1 60.96,39.37 62.74,39.37 JP3.2
  Top 0.305: U2.23 arc45 31.34,10.92 32.26,10.92 arc90 32.77,11.43 32.77,12.19 arc-90 33.27,12.7 33.78,12.7 arc90 34.04,12.95 arc-90 34.54,13.46 35.81,13.46 arc-90 v36.83,12.45 | v64.26,11.18 v55.12,11.18 | 62.74,39.37 arc-90 63.5,38.61 63.5,36.83 arc-90 62.74,36.07 arc90 62.48,35.81 62.48,32.51 arc90 63.75,31.24 64.01,31.24 arc-90 64.77,30.48 64.77,27.69 arc90 65.91,26.54 67.31,26.54 | J.3 68.58,10.67 arc-90 69.34,11.43 arc90 69.85,11.94 69.85,22.61 arc90 67.56,24.89 59.94,24.89 arc-90 58.67,26.16 58.67,37.08 arc-90 60.96,39.37
  Bottom 0.305: J.3 arc-90 67.06,7.37 65.79,7.37 arc-90 64.77,8.38 64.77,10.67 arc90 v64.26,11.18 | v55.12,11.18 arc90 53.85,9.91 53.85,8.89 arc-90 51.31,6.35 43.94,6.35 arc-90 43.43,6.86 38.1,6.86 arc-90 36.83,8.13 v36.83,12.45
D1  (via drill 0.35)
  Top 0.305: U2.24 arc-90 U2.24 32.26,10.16 arc45 32.69,10.34 32.99,10.64 arc45 33.52,11.92 arc-90 33.54,11.94 35.31,11.94 arc90 35.56,12.19 v35.56,12.45
  Bottom 0.305: U$5.PIN12 38.88,39.39 arc-45 40.68,40.13 46.19,40.13 arc-45 47.99,39.39 49.29,38.08 arc-45 50.04,36.29 50.04,30.18 arc-45 47.92,25.06 37.7,14.84 arc-45 36.83,14.48 36.1,13.75 arc45 v35.56,12.45
D2  (via drill 0.35)
  Top 0.305: v31.75,8.38 arc-45 32.42,8.66 U2.25
  Bottom 0.305: U$5.PIN$9 30.44,39.67 arc45 28.7,40.39 24.42,40.39 arc45 22.62,39.64 19.05,36.07 arc45 18.8,35.45 18.8,21.08 arc90 20.1,19.78 21.66,19.78 28.25,19.78 arc-45 31.27,18.53 31.48,18.32 arc-135 30.72,16.48 arc6 27.5,16.32 arc90 24.13,12.95 24.13,11.68 arc90 27.69,8.13 31.5,8.13 arc90 v31.75,8.38
D3  (via drill 0.35)
  Top 0.305: U2.26 33.56,7.44 arc-45 33.53,7.37 arc-90 33.02,6.86 31.5,6.86 arc-90 28.96,9.4 arc90 28.19,10.16 25.91,10.16 arc90 24.38,8.64 arc-90 23.37,7.62 v9.65,7.62 | v15.49,22.35 31.75,22.35 arc90 32.26,22.86 32.26,24.89 arc90 v31.75,25.4
  Bottom 0.305: U$5.PIN$8 28.4,39.07 arc45 27.69,37.34 27.69,30.52 arc45 28.43,28.72 v31.75,25.4 | v9.65,7.62 9.65,19.81 arc-90 12.19,22.35 v15.49,22.35
D4  (via drill 0.35)
  Top 0.305: U2.13 35.16,19.2 arc90 35.05,19.3 v32.51,19.3
  Bottom 0.305: U$5.PIN$6 arc45 28.81,23.01 v32.51,19.3
DTR
  Top 0.305: C3.1 27.43,8.38 arc-90 26.16,7.11 24.13,7.11 arc90 23.62,6.6 23.62,2.03 arc90 24.13,1.52 27.18,1.52 31.75,1.52 J6.DTR
E
  Bottom 0.305: R5.2 44.96,28.74 arc-45 44.21,26.94 U$5.PIN$1
F
  Bottom 0.305: R6.2 U$5.PIN$10
G
  Bottom 0.305: R7.2 30.24,25.76 arc-45 30.99,23.96 U$5.PIN$5
MISO  (via drill 0.35)
  Top 0.152: v9.14,37.59 9.14,37.85 10.31,39.02 IC3.2
  Top 0.305: J2.1 53.85,7.62 arc90 52.83,6.6 52.83,6.35 arc-90 v50.55,4.06 | v31.75,4.32 25.65,4.32 arc90 24.89,3.56 J3.2 | U2.16 31.05,17.25 arc-45 v30.99,17.27
  Bottom 0.305: v9.14,37.59 arc-90 10.92,39.37 14.22,39.37 arc-90 16.26,37.34 16.26,17.78 arc90 19.3,14.73 20.32,14.73 arc-90 21.84,13.21 21.84,4.83 arc-90 21.34,4.32 arc90 20.83,3.81 20.83,2.54 arc90 21.59,1.78 23.88,1.78 24.89,2.79 J3.2 23.11,4.83 23.11,12.95 arc-90 27.43,17.27 v30.99,17.27 | v31.75,4.32 47.24,4.32 arc90 47.5,4.06 v50.55,4.06
MOSI  (via drill 0.35)
  Top 0.305: IC3.5 12.26,40.45 arc-45 12.45,40.89 12.7,41.15 15.75,41.15 arc-90 17.78,39.12 v17.78,38.1 | U2.15 33.56,14.19 arc-90 33.08,13.72 v33.02,13.72 | v20.83,16.76 22.1,16.76 arc-90 23.11,15.75 arc90 25.4,13.46 27.69,13.46 arc-45 28.55,13.1 v28.96,12.7
  Bottom 0.305: J2.4 57.64,4.55 arc-45 55.84,3.81 52.32,3.81 arc90 51.31,2.79 arc-90 50.29,1.78 28.7,1.78 arc-90 J3.3 27.43,4.57 arc-90 28.45,5.59 31.24,5.59 arc90 34.29,8.64 34.29,10.16 arc-90 34.54,10.41 arc90 35.05,10.92 arc90 34.54,11.43 arc-90 33.78,12.19 arc90 33.27,12.7 33.02,12.7 | v20.83,16.76 arc-90 17.78,19.81 v17.78,38.1 | 33.02,12.7 v28.96,12.7 | v33.02,13.72 33.02,12.7
N$1
  Top 0.152: MICROSD.CD_SW_1 17.25,24.15 TP6.P$1
N$2
  Top 0.152: MICROSD.CD_SW_2 16.55,35.35 TP8.P$1
N$5
  Bottom 0.305: JP1.3 14.17,9.6 arc90 14.99,10.41 14.99,10.92 arc-90 15.88,11.81 R10.1
N$6
  Bottom 0.305: JP1.1 12.95,12.45 arc-90 13.97,13.46 18.93,13.46 arc-90 R11.2
N$10
  Top 0.203: TP5.P$1 38.23,43.05
  Top 0.305: TP5.P$1 arc90 36.78,44.5 JP2.1 | MIC5205.5 50.23,42.86 arc-90 49.02,41.66 46.86,41.66 arc-90 C6.1 C7.1 38.23,43.05 | 38.23,43.05 arc-90 TP5.P$1 | TP5.P$1 arc-90 38.23,43.05
N$11
  Bottom 0.305: U$3.A 61.93,29.67 arc-45 TP4.P$1 arc45 59.69,27.73 59.69,22.05 arc45 60.2,20.83 60.39,20.64 arc45 U$2.1
N$13
  Bottom 0.152: C10.1 12.38,42.86 12.57,42.67
  Bottom 0.305: IC2.4 17.71,45.4 arc90 17.02,44.7 17.02,43.18 arc-90 16.51,42.67 12.57,42.67 arc-90 12.38,42.86
N$14  (via drill 0.35)
  Top 0.203: IC1.3 66.67,29.08
  Top 0.305: IC1.3 66.42,29.08 arc-90 65.53,29.97 65.53,31.5 arc90 v64.01,33.02
  Bottom 0.305: v64.01,33.02 63.03,33.02 arc45 61.23,32.28 TP3.P$1 | U$6.C 60.94,34.53 arc45 60.2,32.73 TP3.P$1 | TP3.P$1 59.21,30.26 arc45 58.67,28.96 58.67,17.02 arc45 59.12,15.93 U$1.1
N$15  (via drill 0.35)
  Top 0.152: IC1.8 61.47,25.84 v61.47,25.65
  Top 0.305: JP4.2 69.34,36.58 arc-90 68.83,36.07 arc90 68.07,35.31 v68.07,32.51
  Bottom 0.152: U$2.2 62.17,22.99 62.99,22.17 62.99,19.05 61.47,17.53 U$1.2
  Bottom 0.305: U$2.2 v61.47,25.65 61.47,25.94 arc-90 TM1.3 arc45 64.01,28.45 v68.07,32.51
N$16  (via drill 0.35)
  Top 0.152: 68.33,27.94 v69.6,27.94
  Top 0.203: IC1.2 67.5,27.94 68.33,27.94
  Bottom 0.305: TM1.2 arc-90 67.79,27.94 v69.6,27.94
N$18  (via drill 0.35)
  Top 0.305: MIC5205.4 arc-90 48.36,43.18 v49.28,43.18 | v55.12,43.18 57.02,43.18 arc-90 C8.1
  Bottom 0.305: v49.28,43.18 v55.12,43.18
PIN_A  (via drill 0.35)
  Top 0.305: v39.62,8.38 39.03,8.38 arc-45 U2.32
  Bottom 0.305: R1.1 38.37,31.13 arc45 39.12,32.93 39.12,35.35 arc45 38.61,36.58 38.08,37.1 arc-45 37.34,38.9 37.34,39.77 arc-45 37.59,40.39 arc-45 38.82,40.89 46.45,40.89 arc-45 48.24,40.15 50.01,38.38 50.56,37.83 arc-45 51.31,36.03 51.31,15.49 51.31,15.24 51.31,10.88 arc-45 50.8,9.65 50.27,9.13 arc-45 48.48,8.38 v39.62,8.38
PIN_B  (via drill 0.35)
  Top 0.305: U2.1 38.11,10.15 arc-90 v37.59,10.67 | v37.08,13.72 v37.08,15.49
  Bottom 0.305: R2.1 arc45 22.61,34.12 22.61,36.22 arc45 22.35,36.83 arc45 21.74,37.08 21.59,37.08 20.25,35.74 arc45 20.07,35.31 20.07,21.84 arc90 20.32,21.59 28.96,21.59 arc-45 29.39,21.41 31.72,19.08 arc45 33.02,18.54 arc-45 34.75,17.82 v37.08,15.49 | v37.59,10.67 37.59,13.21 arc90 v37.08,13.72
PIN_C  (via drill 0.35)
  Top 0.305: U2.2 arc-45 39.77,10.92 v38.61,10.92
  Bottom 0.305: R3.1 31.51,34.69 arc45 32.26,36.49 32.26,39.88 33.04,40.66 arc-45 34.83,41.4 47.75,41.4 50.95,38.2 51.83,37.32 arc-45 52.58,35.52 52.58,10.45 arc-45 51.83,8.65 51.29,8.11 arc-45 49.49,7.37 39.37,7.37 arc-45 38.94,7.55 38.1,8.38 38.1,9.7 arc-45 v38.61,10.92
PIN_D  (via drill 0.35)
  Top 0.305: U2.9 38.38,17.26 arc45 v39.62,17.78
  Bottom 0.305: R4.1 41.15,37.23 arc-45 41.4,37.85 arc-45 42.63,38.35 46.7,38.35 arc-45 48.5,37.61 48.77,37.34 arc-45 49.28,36.11 49.28,30.35 arc-45 47.21,25.37 v39.62,17.78
PIN_E  (via drill 0.35)
  Top 0.305: U2.10 37.56,17.75 arc-90 v38.35,18.54
  Bottom 0.305: R5.1 44.96,37.08 arc-45 45.14,37.52 45.47,37.85 46.74,37.85 arc-45 47.6,37.49 48.01,37.08 48.01,27.43 39.12,18.54 v38.35,18.54
PIN_F  (via drill 0.35)
  Top 0.305: v36.58,18.54 arc-45 36.76,18.1 U2.11
  Bottom 0.305: R6.1 34.05,29.57 arc-45 34.8,27.77 34.8,20.83 36.58,19.05 v36.58,18.54
PIN_G  (via drill 0.35)
  Top 0.305: v23.88,20.57 34.29,20.57 arc-90 35.96,18.9 35.96,18.8 U2.12
  Bottom 0.305: R7.1 25.91,38.86 25.25,39.52 arc45 24.38,39.88 arc45 23.08,39.34 19.56,35.81 arc45 19.3,35.2 19.3,21.34 arc90 20.07,20.57 v23.88,20.57
RESET  (via drill 0.35)
  Top 0.305: R12.2 22.22,9.01 arc90 23.88,10.67 arc-90 25.02,11.81 25.52,11.81 arc-90 v25.65,11.68 arc-90 25.78,11.81 C3.2 | v52.83,2.54 49.02,2.54 arc90 48.77,2.29 arc-90 48.26,1.78 43.43,1.78 arc-90 42.16,3.05 v42.16,5.84 | v36.07,7.37 arc-90 35.96,7.47 U2.29 35.96,10.41 arc45 35.35,10.67 v33.78,10.67
  Bottom 0.305: R9.1 59.96,10.52 arc-45 60.71,8.72 60.71,2.29 arc-90 59.18,0.76 57.4,0.76 arc-90 J2.5 v52.83,2.54 | v33.78,10.67 33.53,10.67 33.08,11.12 arc45 31.71,11.68 v25.65,11.68 | v42.16,5.84 38.97,5.84 arc-45 38.35,6.1 arc45 37.74,6.35 37.08,6.35 arc-90 v36.07,7.37
RX
  Top 0.305: U2.30 36.76,5.69 arc45 37.5,3.9 J6.TXO
SCK  (via drill 0.35)
  Top 0.305: IC3.7 13.56,38.47 arc45 13.72,38.1 14.24,37.57 arc45 16.04,36.83 v17.02,36.83 | U2.17 arc-90 U2.17 | U2.17 v32.51,15.75 arc90 v32.51,15.75 U2.17 | U2.17 arc-90 U2.17 | v18.29,16.26 18.54,16.26 arc90 19.05,16.76 arc-90 19.81,17.53 22.5,17.53 arc-45 23.11,17.27 23.26,17.12 arc-45 23.62,16.26 arc45 24.16,14.96 24.35,14.76 arc45 v25.65,14.22
  Bottom 0.305: J3.4 arc-90 31.5,5.08 34.78,4.84 | 34.78,4.84 35.05,4.83 49.78,4.83 arc-90 50.04,5.08 J2.3 | v25.65,14.22 arc-90 27.18,15.75 v32.51,15.75 arc-90 34.8,13.46 34.8,12.19 arc90 35.31,11.68 arc-90 35.81,11.18 35.81,10.67 arc-90 35.31,10.16 arc90 34.78,9.63 34.78,4.84 | v18.29,16.26 arc-90 17.02,17.53 v17.02,36.83
SCL  (via drill 0.35)
  Top 0.305: v33.27,9.91 35.05,9.91 arc-90 35.16,9.8 U2.28
  Bottom 0.305: v33.27,9.91 33.27,9.65 arc-90 31.24,7.62 26.92,7.62 arc90 26.16,6.86 26.16,1.78 arc-90 25.65,1.27 20.07,1.27 arc-90 J1.2 18.29,6.73 arc-90 R11.1
SD_CS  (via drill 0.35)
  Top 0.152: MICROSD.CS 5.58,27.7 v5.59,27.69
  Top 0.305: IC3.10 13.56,44.04 arc-90 11.68,42.16 8.38,42.16 | 8.38,42.16 8.13,42.16 | 8.38,42.16 | 8.38,42.16 8.13,42.16 | 8.13,42.16 arc90 v5.59,39.62
  Bottom 0.305: v5.59,27.69 v5.59,39.62
SD_D_IN  (via drill 0.35)
  Top 0.305: MICROSD.DATA_IN 7.72,28.8 arc90 v7.87,28.96 | v11.68,38.35 arc-90 11.61,38.42 IC3.4
  Bottom 0.305: v7.87,28.96 7.87,31.75 arc-90 8.38,32.26 9.14,32.26 arc90 11.68,34.8 v11.68,38.35
SD_D_OUT  (via drill 0.35)
  Top 0.152: IC3.3 10.96,40.94 v11.18,41.15
  Top 0.305: MICROSD.DATA_OUT 7.54,33.2 arc90 v7.62,33.27 | v10.92,38.35 10.92,39.71 arc-90 IC3.3
  Bottom 0.305: v7.62,33.27 8.38,33.27 arc90 10.92,35.81 v10.92,38.35 | v11.18,41.15 17.27,41.15 arc-90 17.53,40.89 arc90 17.78,40.64 21.59,40.64 arc45 22.46,41 arc45 23.11,42.59 23.11,44.96 arc-90 24.01,45.85 R8.1
SD_SCLK  (via drill 0.35)
  Top 0.305: MICROSD.SCLK 8.63,31 arc-90 v8.64,30.99 | v12.95,38.35 12.95,39.71 arc90 IC3.6
  Bottom 0.305: v8.64,30.99 10.41,30.99 arc90 12.95,33.53 v12.95,38.35
SDA  (via drill 0.35)
  Top 0.305: U2.27 34.36,3.99 arc90 34.54,3.81 v34.54,0.76
  Bottom 0.305: v34.54,0.76 18.03,0.76 arc-90 J1.1 15.75,7.74 arc-90 R10.2
SS  (via drill 0.35)
  Top 0.305: U2.14 arc-90 34.29,17.32 34.29,18.03 arc90 34.04,18.29 v30.48,18.29 | IC3.9 16,45.59 arc-90 18.54,43.05 v18.54,38.1
  Bottom 0.305: J3.1 22.35,15.75 arc-90 24.89,18.29 | 24.89,18.29 v30.48,18.29 | v18.54,38.1 18.54,37.7 arc-45 18.29,37.08 18.29,20.83 arc90 20.83,18.29 24.89,18.29
TX  (via drill 0.35)
  Top 0.305: U2.31 37.56,5.67 arc45 v37.59,5.59 | J6.RXI 35.81,5.59 arc-90 v35.56,5.84
  Bottom 0.305: v35.56,5.84 35.81,5.59 v37.59,5.59
USB_VCC
  Top 0.203: 9.88,14 TP2.P$1
  Top 0.305: 5.56,14 9.88,14 | 9.88,14 arc-90 TP2.P$1 arc90 9.88,14 | JP2.3 21.46,42.88 arc-45 21.34,42.93 18.02,46.25 arc45 16.22,46.99 2.39,46.99 arc45 1.78,46.74 1.76,46.72 arc45 1.02,44.92 1.02,33.89 arc45 1.27,33.27 arc-45 1.52,32.66 1.52,26.92 arc-45 1.34,26.49 1.34,20.5 arc90 2.79,19.05 arc-90 4.06,17.78 4.06,15.49 arc90 5.56,14 | U$4.1 5.56,14
VCC  (via drill 0.35)
  Top 0.203: JP4.1 v66.04,39.37
  Top 0.305: J.1 60.49,8.89 arc45 58.69,8.15 J2.2 arc90 56.9,6.35 56.9,2.54 arc-90 55.37,1.02 42.93,1.02 arc-90 J6.VCC | v56.39,39.37 arc90 54.86,40.89 36.32,40.89 arc-90 34.54,42.67 | 34.54,42.67 arc90 33.53,43.69 JP2.2 21.84,43.69 arc-90 v21.08,44.45 | U2.18 30.51,14.95 arc-90 29.97,15.49 29.97,17.27 arc90 27.94,19.3 14.73,19.3 arc90 v13.21,17.78 13.21,20.57 arc-90 15.75,23.11 22.86,23.11 arc90 24.38,24.64 24.38,38.61 arc-90 26.92,41.15 33.53,41.15 arc90 34.54,42.16 34.54,42.67 | 38.35,12.85 v38.35,11.68 | v50.29,16.26 53.85,16.26 arc90 v56.39,18.8
  Top 0.406: U2.6 39.16,14.15 arc45 38.1,13.72 38.1,12.95 38.35,12.85 arc45 39.07,12.55 U2.4
  Bottom 0.305: R9.2 57.09,16.19 | 57.09,16.19 58.98,14.3 arc-45 59.44,13.21 arc45 59.62,12.77 J.1 | 57.09,16.19 arc-45 56.39,17.88 v56.39,18.8 v56.39,39.37 v66.04,39.37 | J5.2 11.18,7.87 TP1.P$1 arc-90 11.18,8.38 11.18,10.41 | v13.21,17.78 13.21,15.49 arc-90 12.19,14.48 arc90 11.18,13.46 11.18,10.41 | v38.35,11.68 39.62,11.68 arc-90 40.39,10.92 arc90 41.91,9.4 47.75,9.4 arc90 50.29,11.94 v50.29,16.26 | IC2.1 16.32,43.5 arc90 16.51,43.69 16.51,45.21 arc90 16.32,45.4 IC2.3 arc-90 16.29,46.23 18.8,46.23 arc-90 19.3,45.72 arc90 20.57,44.45 v21.08,44.45 C9.1 | JP1.2 11.18,10.41
VDD  (via drill 0.35)
  Top 0.203: MICROSD.VDD 4.12,29.97 | IC3.1 9.53,39.62 v8.38,39.62
  Top 0.305: MICROSD.VDD arc-90 4.12,29.97 v6.86,29.97
  Bottom 0.203: R8.2 24.89,43.05 | 18.06,43.18 18.06,43.43 IC2.5 | 8.38,42.8 8.32,42.86 C11.1
  Bottom 0.305: 18.06,43.18 18.06,42.2 arc45 18.29,41.66 arc45 18.9,41.4 20.57,41.4 arc45 22.31,42.12 22.35,42.16 22.35,45.51 arc-45 22.86,46.74 arc-45 23.47,46.99 25.91,46.99 arc-90 26.42,46.48 26.42,43.94 arc-90 25.52,43.05 R8.2 | C11.1 arc90 9.27,41.91 16.54,41.91 arc90 18.06,43.43 | TP7.P$1 arc-45 25.58,42.36 24.89,43.05 | v6.86,29.97 6.86,38.1 arc-90 v8.38,39.62 8.38,42.8 arc90 8.32,42.86
XTAL1
  Top 0.305: 40.87,14.95 U2.7
  Top 0.406: Y1.1 41.98,14.49 arc-45 41.4,14.73 arc45 40.87,14.95 | Q1.1 Y1.1 | Y1.1 45.77,14.49 arc-45 R13.2 C2.1
XTAL2
  Top 0.406: U2.8 40.19,15.75 arc45 41.4,16.26 arc-45 41.98,16.49 Y1.3 | Y1.3 arc-45 44.15,16.89 R13.1 C1.1 | Y1.3 Q1.2

### Text on the board
tNames: 9V GND | [ ]T_9V | + | T_CD / [ ] #2 / / / / / / / / / / [ ] #1 | https://github.com/konradwilk/wash-hand-pcb | # / [ ] / [ ] / [ ] / [ ] / [ ] / [ ] / [ ] / [ ] / [ ] / [ ] / [ ] / ASBLY | RST SCK MISO / GND MOSI VCC | 5V 500 mA | USB / [ ] / / / / 5V / [ ] | GND VCC | SDA SCL | SS MISO MOSI SCK | VCC GND D0 | RST TX RX VCC CTS GND
bNames: GND 9V | [ ] 3.3V | IR_D / [ ] / / [ ] / IR_E | Copyright 2020 by / Konrad Rzeszutek Wilk | 5V 500 mA | v1.3b.rc4 | D0 GND VCC